# Altium schematic sheet Sheet1.SchDoc
size A; SheetNumber: 1; SheetTotal: 5
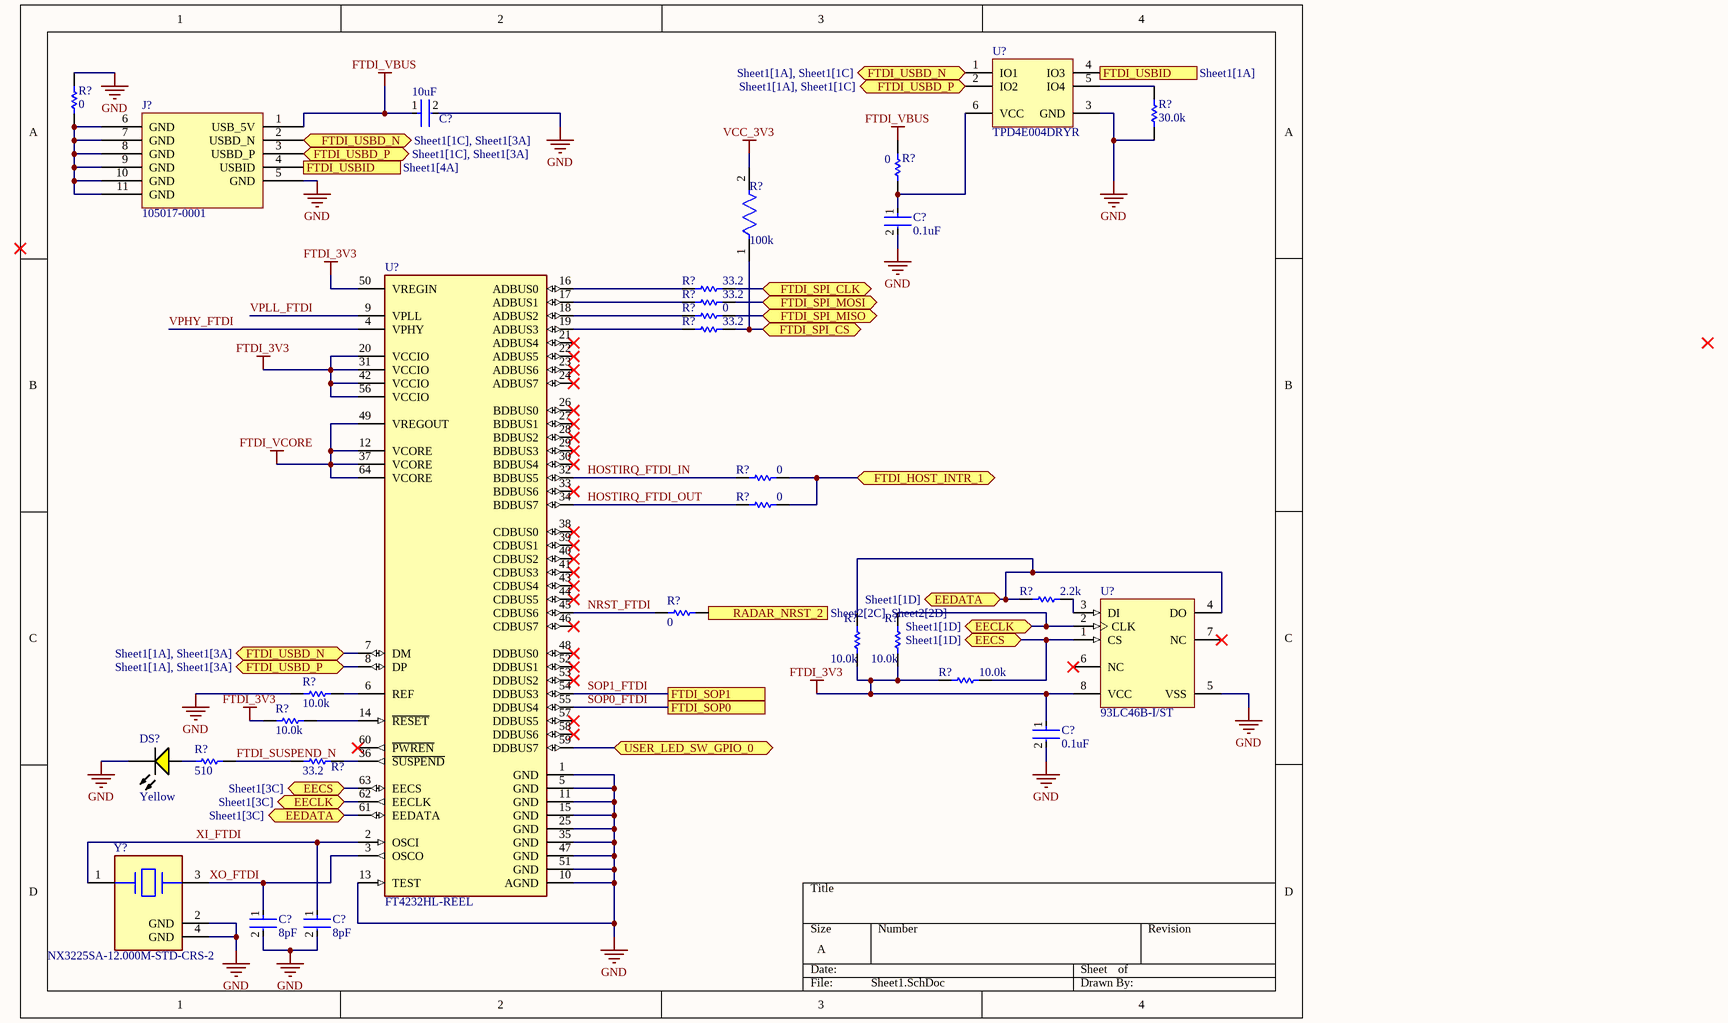
[diagram p0: Sheet1.SchDoc]

## Parts
(Parts that share a designator on the sheet are numbered #1, #2 ... from top to bottom, then left to right.)
C?#1  10uF  [FP-GRM188-0_2-MFG]
C?#2  0.1uF  [FP-C0402-BB-MFG]
C?#3  0.1uF  [FP-C0402-BB-MFG]
C?#4  8pF  [FP-GCM155-0_05-IPC_A]
C?#5  8pF  [FP-GCM155-0_05-IPC_A]
DS?  Yellow  [VISH-TLMY1000_V]
J?  105017-0001
R?#1  0  [RESC1005X40X25LL05T05]
R?#2  30.0k  [RESC1005X40X25LL05T05]
R?#3  0  [RESC1005X40X25LL05T05]
R?#4  100k  [FP-CRCW0402-e3-IPC_C]
R?#5  33.2  [RESC1005X40X25LL05T05]
R?#6  33.2  [RESC1005X40X25LL05T05]
R?#7  33.2  [RESC1005X40X25LL05T05]
R?#8  0  [RESC1005X40X25LL05T05]
R?#9  0  [RESC1005X40X25LL05T05]
R?#10  0  [RESC1005X40X25LL05T05]
R?#11  2.2k  [RESC1005X40X25NL05T05]
R?#12  0  [RESC1005X40X25LL05T05]
R?#13  10.0k  [RESC1005X40X25ML05T10]
R?#14  10.0k  [RESC1005X40X25ML05T10]
R?#15  10.0k  [RESC1005X40X25ML05T10]
R?#16  10.0k  [RESC1005X40X25ML05T10]
R?#17  10.0k  [RESC1005X40X25ML05T10]
R?#18  510  [RESC1005X40X25NL05T05]
R?#19  33.2  [RESC1005X40X25LL05T05]
U?#1  TPD4E004DRYR  [DRY0006A]
U?#2  FT4232HL-REEL  [FP-LQFP-64-MFG]
U?#3  93LC46B-I/ST  [TSSOP-ST8_M]
Y?  NX3225SA-12.000M-STD-CRS-2  [FP-NX3225SA-MFG]

## Ports
EECLK (bidir, see Sheet1[1D]), EECLK (bidir, see Sheet1[3C]), EECS (bidir, see Sheet1[1D]), EECS (bidir, see Sheet1[3C]), EEDATA (bidir, see Sheet1[1D]), EEDATA (bidir, see Sheet1[3C]), FTDI_HOST_INTR_1 (bidir), FTDI_SOP0, FTDI_SOP1, FTDI_SPI_CLK (bidir), FTDI_SPI_CS (bidir), FTDI_SPI_MISO (bidir), FTDI_SPI_MOSI (bidir), FTDI_USBD_N (bidir, see Sheet1[1A], Sheet1[1C]), FTDI_USBD_N (bidir, see Sheet1[1A], Sheet1[3A]), FTDI_USBD_N (bidir, see Sheet1[1C], Sheet1[3A]), FTDI_USBD_P (bidir, see Sheet1[1A], Sheet1[1C]), FTDI_USBD_P (bidir, see Sheet1[1A], Sheet1[3A]), FTDI_USBD_P (bidir, see Sheet1[1C], Sheet1[3A]), FTDI_USBID (see Sheet1[1A]), FTDI_USBID (see Sheet1[4A]), RADAR_NRST_2 (out, see Sheet2[2C], Sheet2[2D]), USER_LED_SW_GPIO_0 (bidir)

## Nets
FTDI_3V3: C?#3.1 R?#13.1 R?#14.1 R?#15.1 R?#17.1 U?#2.20(VCCIO) U?#2.31(VCCIO) U?#2.42(VCCIO) U?#2.50(VREGIN) U?#2.56(VCCIO) U?#3.8(VCC)
FTDI_VBUS: C?#1.1 J?.1(USB_5V) R?#3.2
FTDI_VCORE: U?#2.12(VCORE) U?#2.37(VCORE) U?#2.49(VREGOUT) U?#2.64(VCORE)
GND: C?#1.2 C?#2.2 C?#3.2 C?#4.2 C?#5.2 DS?.2(K) J?.5(GND) R?#1.2 R?#2.1 R?#16.1 U?#1.3(GND) U?#2.1(GND) U?#2.5(GND) U?#2.10(AGND) U?#2.11(GND) U?#2.13(TEST) U?#2.15(GND) U?#2.25(GND) U?#2.35(GND) U?#2.47(GND) U?#2.51(GND) U?#3.5(VSS) Y?.2(GND) Y?.4(GND)
VCC_3V3: R?#4.2
EECLK: R?#14.2 U?#2.62(EECLK) U?#3.2(CLK) ; port EECLK
EECS: R?#15.2 U?#2.63(EECS) U?#3.1(CS) ; port EECS
EEDATA: R?#11.1 R?#13.2 U?#2.61(EEDATA) U?#3.4(DO) ; port EEDATA
FTDI_HOST_INTR_1: R?#9.1 R?#10.1 ; port FTDI_HOST_INTR_1
FTDI_SPI_CLK: R?#5.2 ; port FTDI_SPI_CLK
FTDI_SPI_CS: R?#4.1 R?#7.2 ; port FTDI_SPI_CS
FTDI_SPI_MISO: R?#8.1 ; port FTDI_SPI_MISO
FTDI_SPI_MOSI: R?#6.2 ; port FTDI_SPI_MOSI
FTDI_SUSPEND_N: R?#18.2 R?#19.1
FTDI_USBD_N: J?.2(USBD_N) U?#1.1(IO1) ; port FTDI_USBD_N
FTDI_USBD_P: J?.3(USBD_P) U?#1.2(IO2) U?#2.8(DP) ; port FTDI_USBD_P
FTDI_USBID: J?.4(USBID) U?#1.4(IO3) ; port FTDI_USBID
HOSTIRQ_FTDI_IN: R?#9.2 U?#2.32(BDBUS5)
HOSTIRQ_FTDI_OUT: R?#10.2 U?#2.34(BDBUS7)
NRST_FTDI: R?#12.2 U?#2.45(CDBUS6)
RADAR_NRST_2: R?#12.1 ; port RADAR_NRST_2
SOP0_FTDI: U?#2.55(DDBUS4) ; port FTDI_SOP0
SOP1_FTDI: U?#2.54(DDBUS3) ; port FTDI_SOP1
USER_LED_SW_GPIO_0: U?#2.59(DDBUS7) ; port USER_LED_SW_GPIO_0
VPHY_FTDI: U?#2.4(VPHY)
VPLL_FTDI: U?#2.9(VPLL)
XI_FTDI: C?#5.1 U?#2.2(OSCI) Y?.1
XO_FTDI: C?#4.1 U?#2.3(OSCO) Y?.3
NetC?#2_1: C?#2.1 R?#3.1 U?#1.6(VCC)
NetDS?_1: DS?.1(A) R?#18.1
NetJ?_6: J?.6(GND) J?.7(GND) J?.8(GND) J?.9(GND) J?.10(GND) J?.11(GND) R?#1.1
NetR?#2_2: R?#2.2 U?#1.5(IO4)
NetR?#5_1: R?#5.1 U?#2.16(ADBUS0)
NetR?#6_1: R?#6.1 U?#2.17(ADBUS1)
NetR?#7_1: R?#7.1 U?#2.19(ADBUS3)
NetR?#8_2: R?#8.2 U?#2.18(ADBUS2)
NetR?#11_2: R?#11.2 U?#3.3(DI)
NetR?#16_2: R?#16.2 U?#2.6(REF)
NetR?#17_2: R?#17.2 U?#2.14(~{RESET})
NetR?#19_2: R?#19.2 U?#2.36(~{SUSPEND})

Not connected (* = marked no-connect by the designer): U?#2 7(DM) 21(ADBUS4)* 22(ADBUS5)* 23(ADBUS6)* 24(ADBUS7)* 26(BDBUS0)* 27(BDBUS1)* 28(BDBUS2)* 29(BDBUS3)* 30(BDBUS4)* 33(BDBUS6)* 38(CDBUS0)* 39(CDBUS1)* 40(CDBUS2)* 41(CDBUS3)* 43(CDBUS4)* 44(CDBUS5)* 46(CDBUS7)* 48(DDBUS0)* 52(DDBUS1)* 53(DDBUS2)* 57(DDBUS5)* 58(DDBUS6)* 60(~{PWREN})*; U?#3 6(NC)* 7(NC)*

## Library data of the parts
C?#1 = CMP-06035-002932-1: Chip Multilayer Ceramic Capacitors for General Purpose, 0603, 10uF, X6S, 22%, 20%, 10V; Case Code (Metric): 1608; Max Operating Temperature: 105°C; Voltage Rating (DC): 10V; Thickness: 0.031inch; Width: 0.031inch; Dielectric: X6S; Lead Free: Lead Free; REACH SVHC: No SVHC; Case/Package: 0603; Length: 0.063inch; Min Operating Temperature: -55°C; Package Quantity: 4000; Voltage Rating: 10V; Tolerance: 20%; Capacitance: 10uF; Packaging: Cut Tape; Material: Ceramic; Mount: Surface Mount; Case Code (Imperial): 0603; Height: 0.8mm
C?#2 C?#3 = CMP-2008-03086-2: CAP CER 0.1UF 10V X7R 0402; Manufacturer Part Number: C0402C104K8RACTU; Manufacturer: Kemet; Capacitance: 0.10 μF; Tolerance: 0.1; Temperature Coefficient: 15%; Value: 0.10 μF; Material: Ceramic; Automotive: No; Temperature Range High: +125°C; Octopart: https://octopart.com/c0402c104k8ractu-kemet-106349; ComponentLink2Description: Datasheet; ComponentLink2URL: https://content.kemet.com/datasheets/KEM_C1002_X7R_SMD.pdf; Temperature: -55°C to +125°C; RoHS: TRUE; Temperature Range Low: -55°C; Temperature Characteristic: X7R; Lead Free: Yes; Height: 0.55mm; Voltage Rating: 10 V; Category: Cap; Device Class L3: Ceramic Capacitors; Digikey Description: CAP CER 0.1UF 10V X7R 0402; Package: C0402-BB; Device Class L1: Passive Components; Ipc Land Pattern Name: CAPC10050X50; Mouser Description: Multilayer Ceramic Capacitors MLCC - SMD/SMT 10volts 0.1uF X7R 10%; Device Class L2: Capacitors
C?#4 C?#5 = CMP-06035-000126-2: Ceramic Capacitor for Automotive 8pF ±0.5pF 50VDC C0G 0402 Paper T/R; Voltage Rating: 50V; Case Code (Imperial): 0402; Thickness: 0.022inch; Length: 1mm; Depth: 0.5mm; Capacitance: 8pF; Termination: SMD/SMT; Dielectric: C0G; Lead Free: Lead Free; Min Operating Temperature: -55°C; Height: 0.5mm; Weight: 0.000212oz; Ratings: AEC-Q200; Case/Package: 0402; Width: 0.02inch; Mount: Surface Mount; Packaging: Tape and Reel; Max Operating Temperature: 125°C; Voltage Rating (DC): 50V; Package Quantity: 10000; Case Code (Metric): 1005
DS? = CMP-2000-07255-1: Low Current LED, 40 mW, -40 to 100 degC, 2-Pin SMD, RoHS, Tape and Reel; Manufacturer: Vishay; Wavelength Typ: 595nm; Forward Current If: 2mA; Viewing Angle: 80°; Bulb Size: 1.6mmx0.8mm; Forward Voltage: 1.8V; Luminous Intensity: 7.5mcd; SVHC: ToBeAdvised; Automotive Qualification Standard: AEC-Q100; Lens Shape: Rectangular; LED Mounting: SMD; Mounting Technology: SurfaceMount; Packaging: CutTape; MSL: MSL2-1year; Datasheet URL: http://www.vishay.com/docs/83172/tlmo1000.pdf; Package Reference: TLMY1000; Manufacturer URL: http://www.vishay.com/; Package Description: 2-Pin Surface Mount Device, Body 1.6 x 0.8 mm; LED Colour: Yellow; Datasheet Version: Rev. 2.0, 09/2013; Product Range: -
J? = 105017-0001: Conn Micro USB 2.0 Type B RCP 5 POS 0.65mm Solder RA SMD 5 Terminal 1 Port Micro-USB T/R; Manufacturer: Molex; Manufacturer Lifecycle Status: ACTIVE; Connector Type: Receptacle, USB; Contact Resistance: 30mΩ; Current Rating: 2.5A; Dielectric Material: Liquid Crystal Polymer; Gender: Female; Insulation Resistance: 1GΩ; Max Voltage Rating (AC): 30V; Number of Circuits: 5; Number of Ports: 1; Pitch: 650µm; Plating: Gold; USB Standard: USB 2.0; Supplier: DigiKey; Supplier Part Number: WM1399CT-ND; Manufacturer Part Number: 105017-0001; RoHS: Compliant; Category: USB Connectors; Stock: 13151; Pricing: 1=0.92, 10=0.785, 25=0.7356, 50=0.7004, 100=0.667, 250=0.62516, 500=0.59532, 1000=0.56688, 2000=0.53983, 4000=0.51407, 6000=0.49957, 10000=0.4819, 14000=0.47061, 20000=0.45893 (USD); China RoHS: Compliant; Contact Gender: Female; Contact Material: Brass; Contact Plating: Gold; Country of Origin: US; Depth: 7.5mm; Features: Shielded; Halogen Free: Low Halogen; Height: 2.825mm; Housing Material: Polymer; Length: 8.2mm; Lifecycle Status: Production; Max Operating Temperature: 85°C; Min Operating Temperature: -30°C; Mounting Technology: Surface Mount; Number of Contacts: 5; Pins: 5; Number of Positions: 5; Number of Rows: 1; Number of Terminals: 5; Orientation: Right Angle; Radiation Hardening: No; REACH SVHC: Yes; Schedule B: 8536695050, 8536695050|8536695050, 8536695050|8536695050|8536695050, 8536695050|8536695050|8536695050|8536695050; Shell Finish: Tin; Shell Material: Stainless Steel; Terminal Pitch: 650µm; Termination: Solder; Voltage Rating: 30V; Voltage Rating (AC): 30V; ComponentLink1URL: https://datasheet.octopart.com:443/1050170001-Molex-datasheet-142335147.pdf?src-supplier=IHS; ComponentLink1Description: https://datasheet.octopart.com:443/1050170001-Molex-datasheet-142335147.pdf?src-supplier=IHS; ComponentLink2URL: https://datasheet.octopart.com:443/105017-0001-Molex-datasheet-14876665.pdf?src-supplier=Upverter; ComponentLink2Description: https://datasheet.octopart.com:443/105017-0001-Molex-datasheet-14876665.pdf?src-supplier=Upverter; ComponentLink3URL: https://datasheet.octopart.com:443/105017-0001-Molex-datasheet-10100431.pdf?src-supplier=Upverter; ComponentLink3Description: https://datasheet.octopart.com:443/105017-0001-Molex-datasheet-10100431.pdf?src-supplier=Upverter; ComponentLink4URL: https://datasheet.octopart.com:443/1050170001-Molex-datasheet-8355809.pdf?src-supplier=Upverter; ComponentLink4Description: https://datasheet.octopart.com:443/1050170001-Molex-datasheet-8355809.pdf?src-supplier=Upverter; ComponentLink5URL: https://sigma.octopart.com:443/120074112/technical_drawing/Molex-1050170001.pdf?src-supplier=Upverter; ComponentLink5Description: https://sigma.octopart.com:443/120074112/technical_drawing/Molex-1050170001.pdf?src-supplier=Upverter; ComponentLink6URL: https://datasheet.octopart.com:443/105017-0001-Molex-datasheet-13746511.pdf?src-supplier=Sager+Electronics; ComponentLink6Description: https://datasheet.octopart.com:443/105017-0001-Molex-datasheet-13746511.pdf?src-supplier=Sager+Electronics; ComponentLink7URL: https://datasheet.octopart.com:443/105017-0001-Molex-datasheet-154742999.pdf?src-supplier=Master+Electronics; ComponentLink7Description: https://datasheet.octopart.com:443/105017-0001-Molex-datasheet-154742999.pdf?src-supplier=Master+Electronics; ComponentLink8URL: https://datasheet.octopart.com:443/105017-0001-Molex-datasheet-77519180.pdf?src-supplier=Newark; ComponentLink8Description: https://datasheet.octopart.com:443/105017-0001-Molex-datasheet-77519180.pdf?src-supplier=Newark; ComponentLink9URL: https://datasheet.octopart.com:443/105017-0001-Molex-datasheet-66628043.pdf?src-supplier=Newark; ComponentLink9Description: https://datasheet.octopart.com:443/105017-0001-Molex-datasheet-66628043.pdf?src-supplier=Newark; ComponentLink10URL: https://datasheet.octopart.com:443/105017-0001-Molex-datasheet-32867472.pdf?src-supplier=Farnell; ComponentLink10Description: https://datasheet.octopart.com:443/105017-0001-Molex-datasheet-32867472.pdf?src-supplier=Farnell; ComponentLink11URL: https://datasheet.octopart.com:443/105017-0001-Molex-datasheet-24907595.pdf?src-supplier=Farnell; ComponentLink11Description: https://datasheet.octopart.com:443/105017-0001-Molex-datasheet-24907595.pdf?src-supplier=Farnell; ComponentLink12URL: https://datasheet.octopart.com:443/105017-0001-Molex-datasheet-140174740.pdf?src-supplier=RS+(Formerly+Allied+Electronics); ComponentLink12Description: https://datasheet.octopart.com:443/105017-0001-Molex-datasheet-140174740.pdf?src-supplier=RS+(Formerly+Allied+Electronics); ComponentLink13URL: https://datasheet.octopart.com:443/105017-0001-Molex-datasheet-120135174.pdf?src-supplier=RS+(Formerly+Allied+Electronics); ComponentLink13Description: https://datasheet.octopart.com:443/105017-0001-Molex-datasheet-120135174.pdf?src-supplier=RS+(Formerly+Allied+Electronics); ComponentLink14URL: https://datasheet.octopart.com:443/1050170001-Molex-datasheet-137316104.pdf?src-supplier=Future+Electronics; ComponentLink14Description: https://datasheet.octopart.com:443/1050170001-Molex-datasheet-137316104.pdf?src-supplier=Future+Electronics; ComponentLink15URL: https://datasheet.octopart.com:443/105017-0001-Molex-datasheet-44399914.pdf?src-supplier=Electro+Sonic; ComponentLink15Description: https://datasheet.octopart.com:443/105017-0001-Molex-datasheet-44399914.pdf?src-supplier=Electro+Sonic; ComponentLink16URL: https://datasheet.octopart.com:443/105017-0001-Molex-datasheet-41578275.pdf?src-supplier=Electro+Sonic; ComponentLink16Description: https://datasheet.octopart.com:443/105017-0001-Molex-datasheet-41578275.pdf?src-supplier=Electro+Sonic; ComponentLink17URL: https://datasheet.octopart.com:443/105017-0001-Molex-datasheet-23708332.pdf?src-supplier=Electro+Sonic; ComponentLink17Description: https://datasheet.octopart.com:443/105017-0001-Molex-datasheet-23708332.pdf?src-supplier=Electro+Sonic; ComponentLink18URL: http://sigma.octopart.com:80/16324173/rohs_statement/Molex-105017-0001.pdf?src-supplier=Compliance+Statements; ComponentLink18Description: http://sigma.octopart.com:80/16324173/rohs_statement/Molex-105017-0001.pdf?src-supplier=Compliance+Statements; ComponentLink19URL: http://sigma.octopart.com:80/reach_statement/Molex-company-74.pdf?src-supplier=Compliance+Statements; ComponentLink19Description: http://sigma.octopart.com:80/reach_statement/Molex-company-74.pdf?src-supplier=Compliance+Statements; ComponentLink20URL: http://sigma.octopart.com:80/rohs_statement/Molex-company-73.pdf?src-supplier=Compliance+Statements; ComponentLink20Description: http://sigma.octopart.com:80/rohs_statement/Molex-company-73.pdf?src-supplier=Compliance+Statements; ComponentLink21URL: http://sigma.octopart.com:80/conflict_mineral_statement/Molex-company-72.pdf?src-supplier=Compliance+Statements; ComponentLink21Description: http://sigma.octopart.com:80/conflict_mineral_statement/Molex-company-72.pdf?src-supplier=Compliance+Statements
R?#1 R?#3 R?#8-R?#10 R?#12 = CMP-2000-07451-1: Chip Resistor, 0 Ohm, 0.1 W, -55 to 155 degC, 0402 (1005 Metric), RoHS, Tape and Reel; Manufacturer: Panasonic; Voltage Rating (DC): 50V; Temperature Coefficient: 600ppm/��C; Max Power Dissipation: 100mW; Resistance: 0mOhm; Tolerance: 5%; Number of Terminations: 2; Mount: SurfaceMount; Height: 0.35mm; Packaging: TapeandReel; Contact Plating: Tin; Manufacturer URL: http://www.panasonic.com/; Composition: ThickFilm; Max Operating Temperature: 155degC; REACH SVHC: NoSVHC; Case/Package: 0402; Package Reference: 402; Depth: 0.5mm; Package Description: 2-Pin Surface Mount Device, Body 1 x 0.5 mm; Datasheet URL: https://industrial.panasonic.com/cdbs/www-data/pdf/RDA0000/AOA0000C301.pdf; RoHSCompliant: True; Case Code (Imperial): 0402; Military Standard: Not; Min Operating Temperature: -55degC; Power Rating: 100mW; Datasheet Version: 03/2015; Length: 1mm; Case Code (Metric): 1005; Termination: SMD/SMT; Mounting Technology: SurfaceMount; Voltage Rating: 50V; Width: 0.02inch; Package Quantity: 1; Lead Free: LeadFree; Radiation Hardening: No
R?#2 = CMP-1011-00675-2: Part Number: CRCW040230K0FKED; Manufacturer: Vishay Dale
R?#4 = CMP-2002-08123-3: RES Thick Film, 100kΩ, 1%, 0.063W, 100ppm/°C, 0402; Power Rating: 63mW; Resistance: 100kR; Voltage Rating (DC): 50V; Lead Free: Lead Free; Height: 0.35mm; Contact Plating: Tin; Min Operating Temperature: -55°C; Package Quantity: 10000; Case/Package: 0402; Temperature Coefficient: 100ppm/°C; Number of Terminations: 2; Packaging: Tape and Reel; Max Power Dissipation: 63mW; Case Code (Metric): 1005; Mount: Surface Mount; Width: 0.02inch; Termination: SMD/SMT; Length: 1mm; Number of Pins: 2; Weight: 2.3E-05oz; Radiation Hardening: No; Tolerance: 1%; Military Standard: Not; Features: Automotive AEC-Q200; Depth: 0.5mm; Composition: Thick Film; Max Operating Temperature: 155°C; Voltage Rating: 50V; Case Code (Imperial): 0402
R?#5-R?#7 R?#19 = CMP-2002-08532-1: Part Number: CRCW040233R2FKED; Manufacturer: Vishay Dale
R?#11 = CMP-2002-08453-1: Manufacturer: Vishay Dale; Part Number: CRCW04022K20JNED
R?#13-R?#17 = CMP-2002-03043-1: Part Number: CRCW040210K0FKEDHP; Manufacturer: Vishay Dale
R?#18 = CMP-2002-00551-1: Manufacturer: Panasonic; Part Number: ERJ-2GEJ511X
U?#1 = CMP-0326-00024-3: ESD-Protection Array for High-Speed Data Interfaces, 4 Channels, -40 to +85 degC, 6-pin SON (DRY), Green (RoHS & no Sb/Br); Manufacturer: Texas Instruments; USB High Speed: TRUE; IO Capacitance(Typ)(pF): 1.6; IEC 61000-4-2 Air-Gap(+/- kV): 12; SubFamily: ESD Solution; IO Leakage Current(nA): 1; Breakdown Voltage(Min)(V): 6; IEC 61000-4-2 Contact(+/- kV): 8; ComponentLink3Description: URL Link1; ComponentLink3URL: SamplesURL:http://www.ti.com/product/tpd4e004#samples; PackageReference: DRY0006A; ComponentLink2URL: http://www.ti.com/general/docs/lit/getliterature.tsp?genericPartNumber=TPD4E004&fileType=pdf; ComponentLink2Description: Datasheet; DatasheetVersion: SLVS729A; ComponentLink1Description: Manufacturer URL; PackageDescription: 6-Pin Plastic Small Outline No-Lead, 1 x 1.45 x 0.6 mm Body, 0.5 mm Pitch; 1394 / Firewire: TRUE; Serial ATA / eSATA: TRUE; Eco-Plan: Green (RoHS & no Sb/Br); ComponentLink1URL: http://www.ti.com/; PackageVersion: revF, Dec-2011; Mounting Technology: Surface Mount; PartNumber: TPD4E004DRYR
U?#2 = CMP-0078-00021-4: IC USB HS QUAD UART/SYNC 64-LQFP; Manufacturer: FTDI; Number Of Ports: 1; Max Supply Voltage: 3.6V; Data Rate: 480Mbits/s; Nominal Supply Current: 70mA; Usb Standard: USB 2.0; Interface: I2C,SPI,UART,USB,Other; Min Supply Voltage: 3V; Standoff Height: 0.05mm; Ipc Land Pattern Name: QFP50P1200X1200X160-64; ComponentLink2Description: Datasheet; Temperature Range Low: -40°C; Footprint Url: https://www.ftdichip.com/Support/Documents/TechnicalNotes/TN_166%20FTDI%20Example%20IC%20PCB%20Footprints.pdf; Manufacturer Part Number: FT4232HL-REEL; Height: 1.6mm; ComponentLink2URL: https://www.ftdichip.com/Support/Documents/DataSheets/ICs/DS_FT4232H.pdf; Device Class L2: Interface ICs; Ambient Temperature Range Low: -40°C; RoHS: TRUE; Package: LQFP-64; Temperature Range High: +85°C; Digikey Description: IC USB HS QUAD UART/SYNC 64-LQFP; Temperature: -40°C to +85°C; Lead Free: Yes; Device Class L1: Integrated Circuits (ICs); Category: IC; Automotive: No; Ambient Temperature Range High: +85°C; Octopart: https://octopart.com/ft4232hl-reel-ftdi-19172127; Device Class L3: USB Interface ICs
U?#3 = CMP-0162-00453-1: 1K, 64x16-bit, 2.5V Microwire Serial EEPROM, 8-Pin TSSOP, Industrial Temperature; Code_JEDEC: MO-153; PackageDescription: 8-Lead Plastic Thin Shrink Small Outline (ST) - 4.4mm Body [TSSOP]; DatasheetVersion: revG, May-2008; PackageVersion: revBB, Aug-2009; PackageReference: TSSOP-ST8
Y? = CMP-200220-000016-1: Frequency Tolerance: 15ppm; Frequency: 12MHz; Frequency Stability: 50ppm; ESR (Equivalent Series Resistance): 120R; Load Capacitance: 8pF; Case/Package: SMD/SMT; RoHS Compliant: Yes; Mount: Surface Mount; Ratings: AEC-Q200; Length: 0.126inch; Packaging: Tape and Reel; Width: 0.098inch; Min Operating Temperature: -40°C; Height: 0.024inch; Max Operating Temperature: 125°C